# Altium schematic sheet Microcontroleur.SchDoc
size A3; Version: E; Author: Jérémie Jean-Elie; Organization: ETML-ES; Address1: Avenue Recordon 1; Address2: 1004 Lausanne; Address3: Switzerland; Revision: 1; SheetNumber: 5; SheetTotal: 7
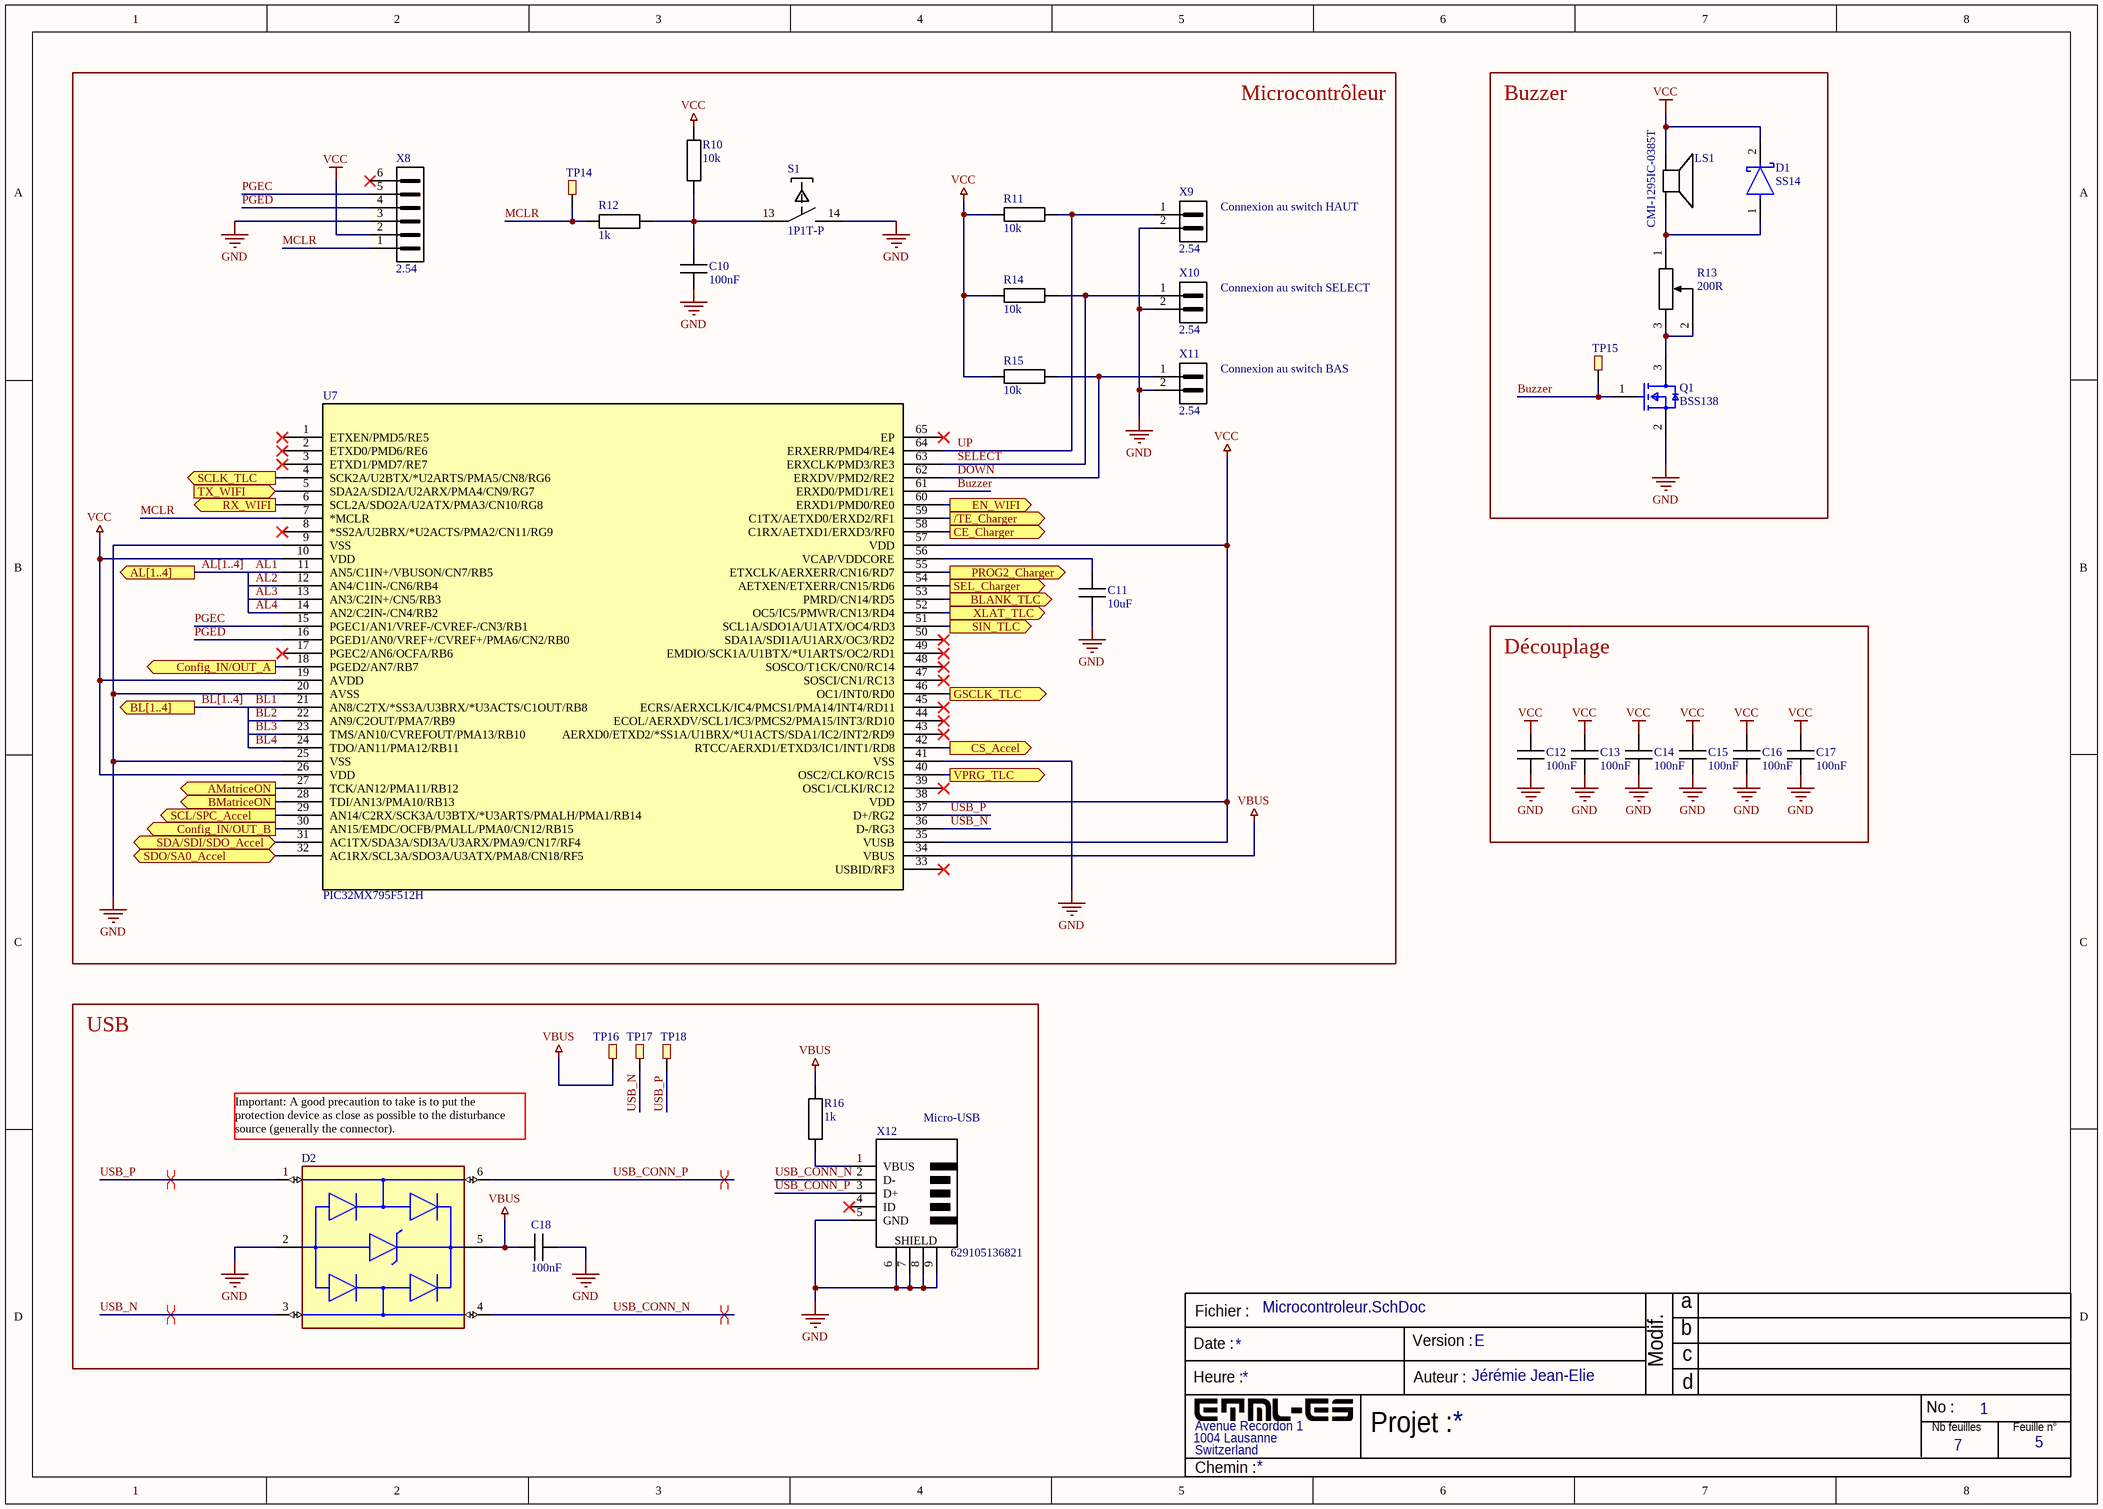
[diagram p0: Microcontroleur.SchDoc]

## Parts
C10  100nF  [CAPC1608X08M]
C11  10uF  [CAPC1608X08M]
C12  100nF  [CAPC1608X08M]
C13  100nF  [CAPC1608X08M]
C14  100nF  [CAPC1608X08M]
C15  100nF  [CAPC1608X08M]
C16  100nF  [CAPC1608X08M]
C17  100nF  [CAPC1608X08M]
C18  100nF  [CAPC1608X08M]
D1  SS14  [FP-403AE-MFG]
D2  USBLC6-2P6  [SOT95P280X145-6N]  (value not drawn)
LS1  CMI-1295IC-0385T  [CMI-1295IC-0385T]
Q1  BSS138  [FP-318-08-IPC_B]
R10  10k  [RESC1608X06M]
R11  10k  [RESC1608X06M]
R12  1k  [RESC1608X06M]
R13  200R  [POT_200r]
R14  10k  [RESC1608X06M]
R15  10k  [RESC1608X06M]
R16  1k  [RESC1608X06M]
S1  1P1T-P  [TE_1825910-6]
TP14  TestPoint  [KEYSTONE_5019]  (value not drawn)
TP15  TestPoint  [KEYSTONE_5019]  (value not drawn)
TP16  TestPoint  [KEYSTONE_5019]  (value not drawn)
TP17  TestPoint  [KEYSTONE_5019]  (value not drawn)
TP18  TestPoint  [KEYSTONE_5019]  (value not drawn)
U7  PIC32MX795F512H  [TQFP64_10x10MC_MCH]
X8  2.54  [PIN-1x06-2.54]
X9  2.54  [PIN-1x02-2.54]
X10  2.54  [PIN-1x02-2.54]
X11  2.54  [PIN-1x02-2.54]
X12  629105136821  [WE_629105136821]

## Blocks framed on the sheet
Microcontrôleur: C10 C11 R10-R12 R14 R15 S1 TP14 U7 X8-X11
Buzzer: D1 LS1 Q1 R13 TP15
Découplage: C12-C17
USB: C18 D2 R16 TP16-TP18 X12

## Ports
/TE_Charger (out, see Schema_bloc[2A], Alimentation[1C]), AL[1..4] (out, see Schema_bloc[2B], Multiplexage_Matrices[3B]), AMatriceON (out, see Schema_bloc[2B], Multiplexage_Matrices[2B]), BL[1..4] (out, see Schema_bloc[2B], Multiplexage_Matrices[3C]), BLANK_TLC (out, see Schema_bloc[2B], Drivers_Matrices[1A]), BMatriceON (out, see Schema_bloc[2B], Multiplexage_Matrices[2C]), CE_Charger (out, see Schema_bloc[2A], Alimentation[2B]), Config_IN/OUT_A (out, see Schema_bloc[2B], Multiplexage_Matrices[1A]), Config_IN/OUT_B (out, see Schema_bloc[2B], Multiplexage_Matrices[1B]), CS_Accel (out, see Schema_bloc[3A], Accelerometre[1B]), EN_WIFI (out, see Schema_bloc[3B], Module_Wi-Fi[1A]), GSCLK_TLC (out, see Schema_bloc[3B], Drivers_Matrices[1A]), PROG2_Charger (out, see Schema_bloc[2A], Alimentation[1B]), RX_WIFI (out, see Schema_bloc[3B], Module_Wi-Fi[1B]), SCL/SPC_Accel (out, see Schema_bloc[3A], Accelerometre[1B]), SCLK_TLC (out, see Schema_bloc[2B], Drivers_Matrices[1A]), SDA/SDI/SDO_Accel (bidir, see Schema_bloc[3A], Accelerometre[1B]), SDO/SA0_Accel (bidir, see Schema_bloc[3A], Accelerometre[1B]), SEL_Charger (out, see Schema_bloc[2A], Alimentation[1B]), SIN_TLC (out, see Schema_bloc[3B], Drivers_Matrices[1B]), TX_WIFI (in, see Schema_bloc[3B], Module_Wi-Fi[1B]), VPRG_TLC (out, see Schema_bloc[2B], Drivers_Matrices[1A]), XLAT_TLC (out, see Schema_bloc[2B], Drivers_Matrices[1A])

## Nets
GND: C10.1 C11.1 C12.1 C13.1 C14.1 C15.1 C16.1 C17.1 C18.2 D2.2(GND) Q1.2(S) S1.14 U7.9(VSS) U7.20(AVSS) U7.25(VSS) U7.41(VSS) X8.3 X9.2 X10.2 X11.2 X12.5(GND) X12.6(SHIELD) X12.7(SHIELD) X12.8(SHIELD) X12.9(SHIELD)
VBUS: C18.1 D2.5(VBUS) R16.2 TP16.1 U7.34(VBUS)
VCC: C12.2 C13.2 C14.2 C15.2 C16.2 C17.2 D1.2(C) LS1.1(+) R10.2 R11.2 R14.2 R15.2 U7.10(VDD) U7.19(AVDD) U7.26(VDD) U7.35(VUSB) U7.38(VDD) U7.57(VDD) X8.2
/TE_Charger: U7.59(C1TX/AETXD0/ERXD2/RF1) ; port /TE_Charger
AL1: U7.11(AN5/C1IN+/VBUSON/CN7/RB5)
AL2: U7.12(AN4/C1IN-/CN6/RB4)
AL3: U7.13(AN3/C2IN+/CN5/RB3)
AL4: U7.14(AN2/C2IN-/CN4/RB2)
AMatriceON: U7.27(TCK/AN12/PMA11/RB12) ; port AMatriceON
BL1: U7.21(AN8/C2TX/*SS3A/U3BRX/*U3ACTS/C1OUT/RB8)
BL2: U7.22(AN9/C2OUT/PMA7/RB9)
BL3: U7.23(TMS/AN10/CVREFOUT/PMA13/RB10)
BL4: U7.24(TDO/AN11/PMA12/RB11)
BLANK_TLC: U7.53(PMRD/CN14/RD5) ; port BLANK_TLC
BMatriceON: U7.28(TDI/AN13/PMA10/RB13) ; port BMatriceON
Buzzer: Q1.1(G) TP15.1 U7.61(ERXD0/PMD1/RE1)
CE_Charger: U7.58(C1RX/AETXD1/ERXD3/RF0) ; port CE_Charger
Config_IN/OUT_A: U7.18(PGED2/AN7/RB7) ; port Config_IN/OUT_A
Config_IN/OUT_B: U7.30(AN15/EMDC/OCFB/PMALL/PMA0/CN12/RB15) ; port Config_IN/OUT_B
CS_Accel: U7.42(RTCC/AERXD1/ETXD3/IC1/INT1/RD8) ; port CS_Accel
DOWN: R15.1 U7.62(ERXDV/PMD2/RE2) X11.1
EN_WIFI: U7.60(ERXD1/PMD0/RE0) ; port EN_WIFI
GSCLK_TLC: U7.46(OC1/INT0/RD0) ; port GSCLK_TLC
MCLR: R12.1 TP14.1 U7.7(*MCLR) X8.1
PGEC: U7.15(PGEC1/AN1/VREF-/CVREF-/CN3/RB1) X8.5
PGED: U7.16(PGED1/AN0/VREF+/CVREF+/PMA6/CN2/RB0) X8.4
PROG2_Charger: U7.55(ETXCLK/AERXERR/CN16/RD7) ; port PROG2_Charger
RX_WIFI: U7.6(SCL2A/SDO2A/U2ATX/PMA3/CN10/RG8) ; port RX_WIFI
SCL/SPC_Accel: U7.29(AN14/C2RX/SCK3A/U3BTX/*U3ARTS/PMALH/PMA1/RB14) ; port SCL/SPC_Accel
SCLK_TLC: U7.4(SCK2A/U2BTX/*U2ARTS/PMA5/CN8/RG6) ; port SCLK_TLC
SDA/SDI/SDO_Accel: U7.31(AC1TX/SDA3A/SDI3A/U3ARX/PMA9/CN17/RF4) ; port SDA/SDI/SDO_Accel
SDO/SA0_Accel: U7.32(AC1RX/SCL3A/SDO3A/U3ATX/PMA8/CN18/RF5) ; port SDO/SA0_Accel
SEL_Charger: U7.54(AETXEN/ETXERR/CN15/RD6) ; port SEL_Charger
SELECT: R14.1 U7.63(ERXCLK/PMD3/RE3) X10.1
SIN_TLC: U7.51(SCL1A/SDO1A/U1ATX/OC4/RD3) ; port SIN_TLC
TX_WIFI: U7.5(SDA2A/SDI2A/U2ARX/PMA4/CN9/RG7) ; port TX_WIFI
UP: R11.1 U7.64(ERXERR/PMD4/RE4) X9.1
USB_CONN_N: D2.4(I/O2) X12.2(D-)
USB_CONN_P: D2.6(I/O1) X12.3(D+)
USB_N: D2.3(I/O2) TP17.1 U7.36(D-/RG3)
USB_P: D2.1(I/O1) TP18.1 U7.37(D+/RG2)
VPRG_TLC: U7.40(OSC2/CLKO/RC15) ; port VPRG_TLC
XLAT_TLC: U7.52(OC5/IC5/PMWR/CN13/RD4) ; port XLAT_TLC
NetC10_2: C10.2 R10.1 R12.2 S1.13
NetC11_2: C11.2 U7.56(VCAP/VDDCORE)
NetD1_1: D1.1(A) LS1.2(-) R13.1
NetQ1_3: Q1.3(D) R13.2 R13.3
NetR16_1: R16.1 X12.1(VBUS)

Not connected (* = marked no-connect by the designer): U7 1(ETXEN/PMD5/RE5)* 2(ETXD0/PMD6/RE6)* 3(ETXD1/PMD7/RE7)* 8(*SS2A/U2BRX/*U2ACTS/PMA2/CN11/RG9)* 17(PGEC2/AN6/OCFA/RB6)* 33(USBID/RF3)* 39(OSC1/CLKI/RC12)* 43(AERXD0/ETXD2/*SS1A/U1BRX/*U1ACTS/SDA1/IC2/INT2/RD9)* 44(ECOL/AERXDV/SCL1/IC3/PMCS2/PMA15/INT3/RD10)* 45(ECRS/AERXCLK/IC4/PMCS1/PMA14/INT4/RD11)* 47(SOSCI/CN1/RC13)* 48(SOSCO/T1CK/CN0/RC14)* 49(EMDIO/SCK1A/U1BTX/*U1ARTS/OC2/RD1)* 50(SDA1A/SDI1A/U1ARX/OC3/RD2)* 65(EP)*; X8 6*; X12 4(ID)*

## Buses and harness runs
bus AL[1..4] = port AL[1..4]
bus BL[1..4] = port BL[1..4]

## Layout directives
differential pair; rule Differential Pairs Routing [Pref Gap = 0.254mm    Min Gap  = 0.254mm    Max Gap  = 0.254mmPref Width = 0.381mm    Min Width  = 0.381mm    Max Width  = 0.381mm]; differential pair class USB_CONN_LINES: USB_CONN_N, USB_CONN_P
differential pair; rule Differential Pairs Routing [Pref Gap = 0.254mm    Min Gap  = 0.254mm    Max Gap  = 0.254mmPref Width = 0.381mm    Min Width  = 0.381mm    Max Width  = 0.381mm]; differential pair class USB_LINES: USB_N, USB_P

## Notes on the sheet
- (near X9) Connexion au switch HAUT
- (near X10) Connexion au switch SELECT
- (near X11) Connexion au switch BAS
- (near X12) Micro-USB
- (near D2) Important: A good precaution to take is to put the protection device as close as possible to the disturbance
  source (generally the connector).
- Fichier :
- a
- Date :
- Heure :
- Version :
- Auteur :
- Modif.
- b
- c
- d
- Projet :
- No :
- Nb feuilles
- Feuille n°
- Chemin :

## Library data of the parts
C10 C12-C18 = CMP-065-000000-2: CAPC 100nF X7R 50V 10% 1608 (0603 INCH); Manufacturer: TDK; Manufacturer Number: CGA3E2X7R1H104K080AA; IsStocked: 1; PN: PN-338083; Current: NULL; TemperatureRange: -55°C to +125°C; Voltage: 50V; Dielectric: X7R; Value: 100nF; Category: Passives; Supplier Price 1: 0.0100; Supplier Part Number 1: FAB.0603_C 100n; SubCategory: Condensateurs ceramique; Tolerance: ±10%; Supplier 1: ETML; TemperatureCoeff: NULL; Power: NULL
C11 = CMP-065-000003-2: CAPC 10uF X5R 10V 20% 1608 (0603 INCH); Manufacturer: TDK; Manufacturer Number: C1608X5R1A106M080AC; TemperatureRange: -55°C to +85°C; IsStocked: 1; Value: 10µF; PN: PN-131657; Supplier Price 1: 0.0944; Tolerance: ±20%; Category: Passives; Dielectric: X5R; SubCategory: Condensateurs ceramique; Supplier 1: ETML; Voltage: 10V; Supplier Part Number 1: FAB.0603_C 10uF
D1 = CMP-2000-04943-2: DIODE SCHOTTKY 40V 1A SMA; Manufacturer: ON Semiconductor; Peak Reverse Current: 0.2mA; Max Junction Temp: +125°C; Standoff Height: 0.05mm; Max Surge Forward Current: 40A; Mouser Description: Schottky Diodes & Rectifiers SMA 40V 1.0A; RoHS: TRUE; Lead Free: Yes; Manufacturer Part Number: SS14; Device Class L3: Schottky Diodes; Category: Diode; Automotive: No; Digikey Description: DIODE SCHOTTKY 40V 1A SMA; ComponentLink2Description: Datasheet; Device Class L2: Diodes; Height: 2.5mm; Temperature Range High: +125°C; ComponentLink2URL: https://www.onsemi.com/pub/Collateral/SS19-D.PDF; Device Class L1: Discrete Semiconductors; Package: 403AE; Octopart: https://octopart.com/ss14-on+semiconductor-29205033; Max Repetitive Reverse Voltage: 40V; Temperature Range Low: -65°C; Forward Current: 1A; Temperature: -65°C to +125°C
LS1 = CMI-1295IC-0385T: 12 mm, 3 Vdc, 85 dB, Through Hole, Driving Circuit, Magnetic Audio Indicator Buzzer; Supplier 1: Mouser; Supplier Part Number 1: 490-CMI-1295IC-0385T
Q1 = CMP-07173-000101-1: MOSFET N-CH 50V 220MA SOT-23; Turn-Off Delay Time: 20ns; Element Configuration: Single; Rds On Max: 3.5R; Gate to Source Voltage (Vgs): 20V; Threshold Voltage: 1.3V; Number of Elements: 1; Power Dissipation: 360mW; Rise Time: 9ns; Turn-On Delay Time: 2.5ns; Input Capacitance: 27pF; On-State Resistance: 6R; Lead Free: Lead Free; Length: 2.92mm; Width: 1.3mm; Drain to Source Breakdown Voltage: 50V; Min Operating Temperature: -55°C; REACH SVHC: No SVHC; Packaging: Tape and Reel; Radiation Hardening: No; Height: 0.93mm; Drain to Source Voltage (Vdss): 50V; Current Rating: 220mA; Voltage Rating (DC): 50V; Weight: 0.03g; Continuous Drain Current (ID): 220mA; Number of Pins: 3; Nominal Vgs: 1.3V; Max Power Dissipation: 360mW; Fall Time: 9ns; Drain to Source Resistance: 3.5R; Contact Plating: Tin; Case/Package: SOT-23; Package Quantity: 1; Dual Supply Voltage: 50V; Mount: Surface Mount; Termination: SMD/SMT; Max Operating Temperature: 150°C
R10 R11 R14 R15 = CMP-066-000124-2: RES 10kohm  ±1% 0.1W  1608 (0603 INCH); Manufacturer Number: RC0603FR-0710KL; Manufacturer: Yageo; TemperatureRange: -55°C to 155°C; Voltage: 75V; TemperatureCoeff: ±100ppm/°C; PN: PN-896786; IsStocked: 1; Category: Passives; Tolerance: ±1%; Value: 10k; Supplier Part Number 1: FAB.0603_R 10k; Power: 0.1W; Supplier Price 1: 0.0200; Supplier 1: ETML; SubCategory: Resistances couche epaisse
R12 R16 = CMP-066-000112-2: RES 1.0kohm  ±1% 0.1W  1608 (0603 INCH); Manufacturer Number: RC0603FR-071KL; Manufacturer: Yageo; TemperatureRange: -55°C to 155°C; PN: PN-368287; IsStocked: 1; Voltage: 75V; TemperatureCoeff: ±100ppm/°C; Power: 0.1W; Tolerance: ±1%; Supplier Price 1: 0.0100; Category: Passives; Value: 1k; SubCategory: Resistances couche epaisse; Supplier 1: ETML; Supplier Part Number 1: FAB.0603_R 1k
R13 = Pot_200R: Value: 200R
S1 = CMP-058-000005-2: SW 600X600X500 24V 50mA THT; Manufacturer Number: 1825910-6; Manufacturer: TE Connectivity; TemperatureRange: -35°C to +85 °C; IsStocked: True; PN: PN-638027; Voltage: 24V; Current: 50mA; SubCategory: Commutateurs; Category: Electromechanical; Supplier Part Number 1: 135-66-547; Supplier 1: Distrelec AG; Supplier Price 1: 0.1642; Value: 1P1T-P
X8 = CMP-055-000011-1: PIN HEADER 2.54 1x06; Manufacturer Number: 61300411121; Manufacturer: Würth Electronik; IsStocked: True; PN: PN-823777; TemperatureRange: -40°C to +105°C; Voltage: 250V; Current: 3A; Supplier Part Number 1: MAG.283.897; Value: 2.54; Category: Connectors; Supplier Price 1: 1.2; Supplier 1: ETML; SubCategory: Pin Header
X9-X11 = CMP-055-000006-1: PIN HEADER 2.54 1x02; Manufacturer Number: 61300211121; Manufacturer: Würth Electronik; IsStocked: True; PN: PN-573903; Voltage: 250V; Current: 3A; TemperatureRange: -40°C to +105°C; Supplier Part Number 1: MAG.283.897; Supplier Price 1: 0.04; Supplier 1: ETML; SubCategory: Pin Header; Category: Connectors; Value: 2.54
X12 = CMP-054-000011-1: USB MICRO 5P Horizontal SMT; Manufacturer: Würth Electronik; PN: PN-869488; TemperatureRange: -40°C to +85°C; IsStocked: True; SubCategory: USB; Value: 629105136821; Supplier 1: ETML; Category: Connectors; Manufacturer Number: 629105136821; Supplier Price 1: 1.48; Supplier Part Number 1: MAG.246.110
D2 = USBLC6-2P6: Supplier 1: Mouser; Supplier Part Number 1: 511-USBLC6-2P6